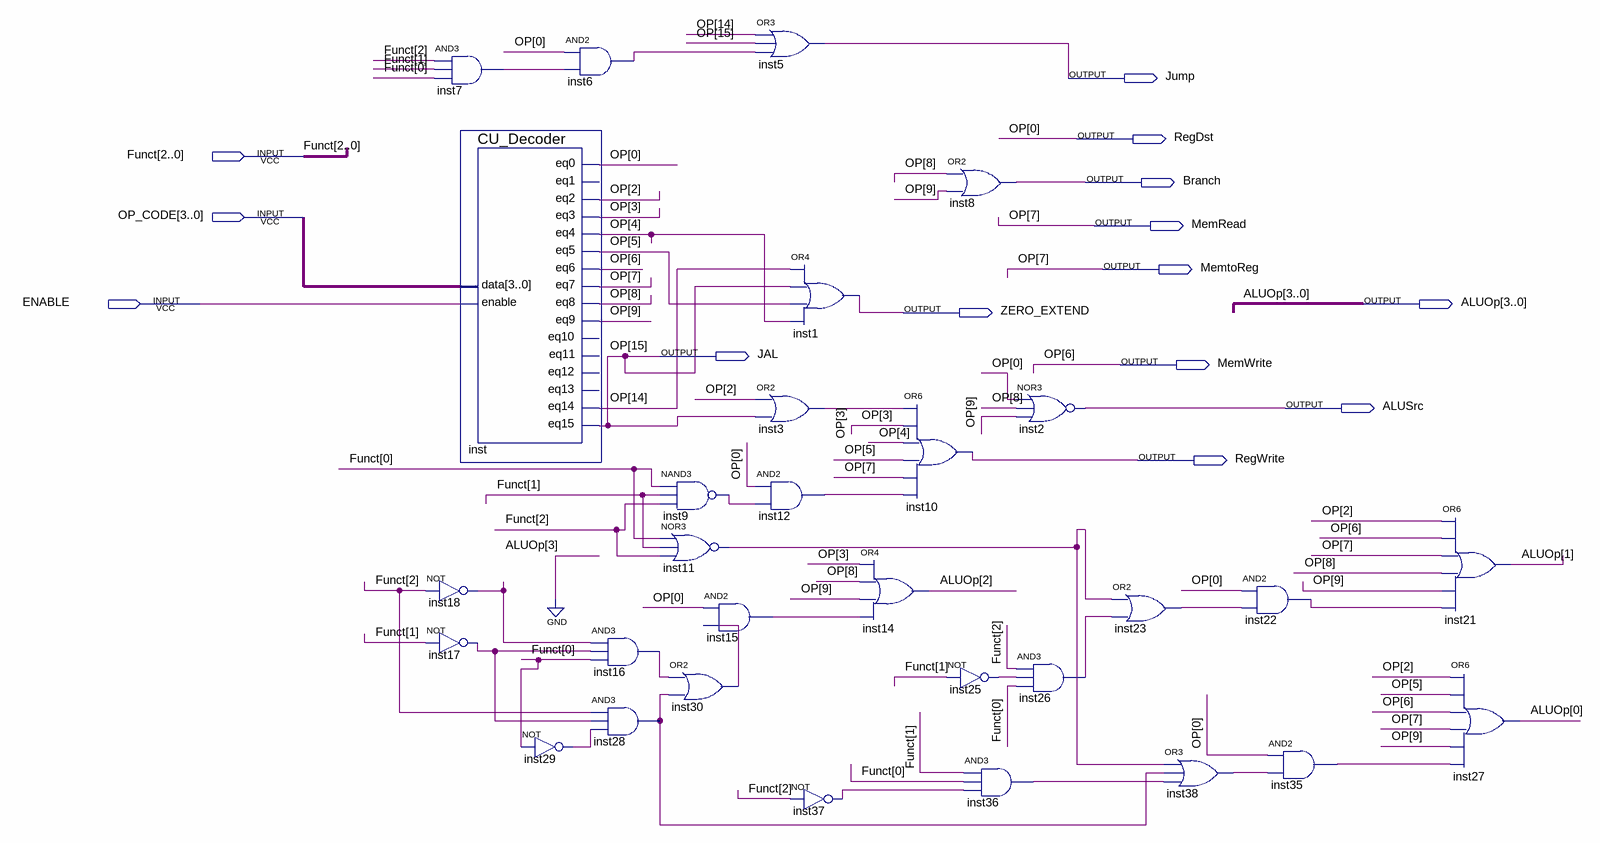
[diagram p0: schematic sheet]
// Quartus schematic Control.bdf as structural Verilog: 30 symbols, 14 pins
module Control (
  input  [2:0] Funct,
  input  [3:0] OP_CODE,
  input  ENABLE,
  output Jump,
  output RegDst,
  output Branch,
  output MemRead,
  output MemtoReg,
  output [3:0] ALUOp,
  output ZERO_EXTEND,
  output JAL,
  output MemWrite,
  output ALUSrc,
  output RegWrite
);

  wire inst3_out, inst6_out, inst7_out, inst9_out, inst11_out, inst12_out, inst15_out, inst16_out,
       inst17_out, inst18_out, inst22_out, inst23_out, inst25_out, inst26_out, inst28_out, inst29_out,
       inst30_out, inst35_out, inst36_out, inst37_out, inst38_out;
  wire [14:2] OP;

  and inst7 (inst7_out, Funct[2], Funct[1], Funct[0]);
  CU_Decoder inst (
    .data(OP_CODE), .enable(ENABLE), .eq0(RegDst), .eq2(OP[2]), .eq3(OP[3]), .eq4(OP[4]), .eq5(OP[5]),
    .eq6(MemWrite), .eq7(MemRead), .eq8(OP[8]), .eq9(OP[9]), .eq14(OP[14]), .eq15(JAL));  // open: eq1, eq10, eq11, eq12, eq13
  not inst18 (inst18_out, Funct[2]);
  not inst17 (inst17_out, Funct[1]);
  not inst29 (inst29_out, Funct[0]);
  and inst6 (inst6_out, RegDst, inst7_out);
  and inst16 (inst16_out, inst18_out, inst17_out, Funct[0]);
  and inst28 (inst28_out, Funct[2], inst17_out, inst29_out);
  nand inst9 (inst9_out, Funct[0], Funct[1], Funct[2]);
  nor inst11 (inst11_out, Funct[0], Funct[1], Funct[2]);
  or inst30 (inst30_out, inst16_out, inst28_out);
  or inst5 (Jump, OP[14], JAL, inst6_out);
  or inst3 (inst3_out, OP[2], JAL);
  and inst12 (inst12_out, RegDst, inst9_out);
  and inst15 (inst15_out, RegDst, inst30_out);
  or inst1 (ZERO_EXTEND, OP[14], JAL, OP[5], OP[4]);
  not inst37 (inst37_out, Funct[2]);
  or inst10 (RegWrite, inst3_out, OP[3], OP[4], OP[5], MemRead, inst12_out);
  or inst14 (ALUOp[2], OP[3], OP[8], OP[9], inst15_out);
  or inst8 (Branch, OP[8], OP[9]);
  not inst25 (inst25_out, Funct[1]);
  and inst36 (inst36_out, Funct[1], Funct[0], inst37_out);
  nor inst2 (ALUSrc, RegDst, OP[8], OP[9]);
  and inst26 (inst26_out, Funct[2], inst25_out, Funct[0]);
  or inst23 (inst23_out, inst11_out, inst26_out);
  or inst38 (inst38_out, inst11_out, inst28_out, inst36_out);
  and inst22 (inst22_out, RegDst, inst23_out);
  and inst35 (inst35_out, RegDst, inst38_out);
  or inst21 (ALUOp[1], OP[2], MemWrite, MemRead, OP[8], OP[9], inst22_out);
  or inst27 (ALUOp[0], OP[2], OP[5], MemWrite, MemRead, OP[9], inst35_out);

  assign ALUOp[3] = 1'b0;
  assign MemtoReg = MemRead;

  // Other names for the same wires on the sheet: OP (some bits) = {JAL, MemRead, MemWrite, RegDst}
endmodule
